# Altium schematic sheet Esquema_gen_ETRX.SchDoc
size 599 x 241 mm; SheetNumber: 1; SheetTotal: 5
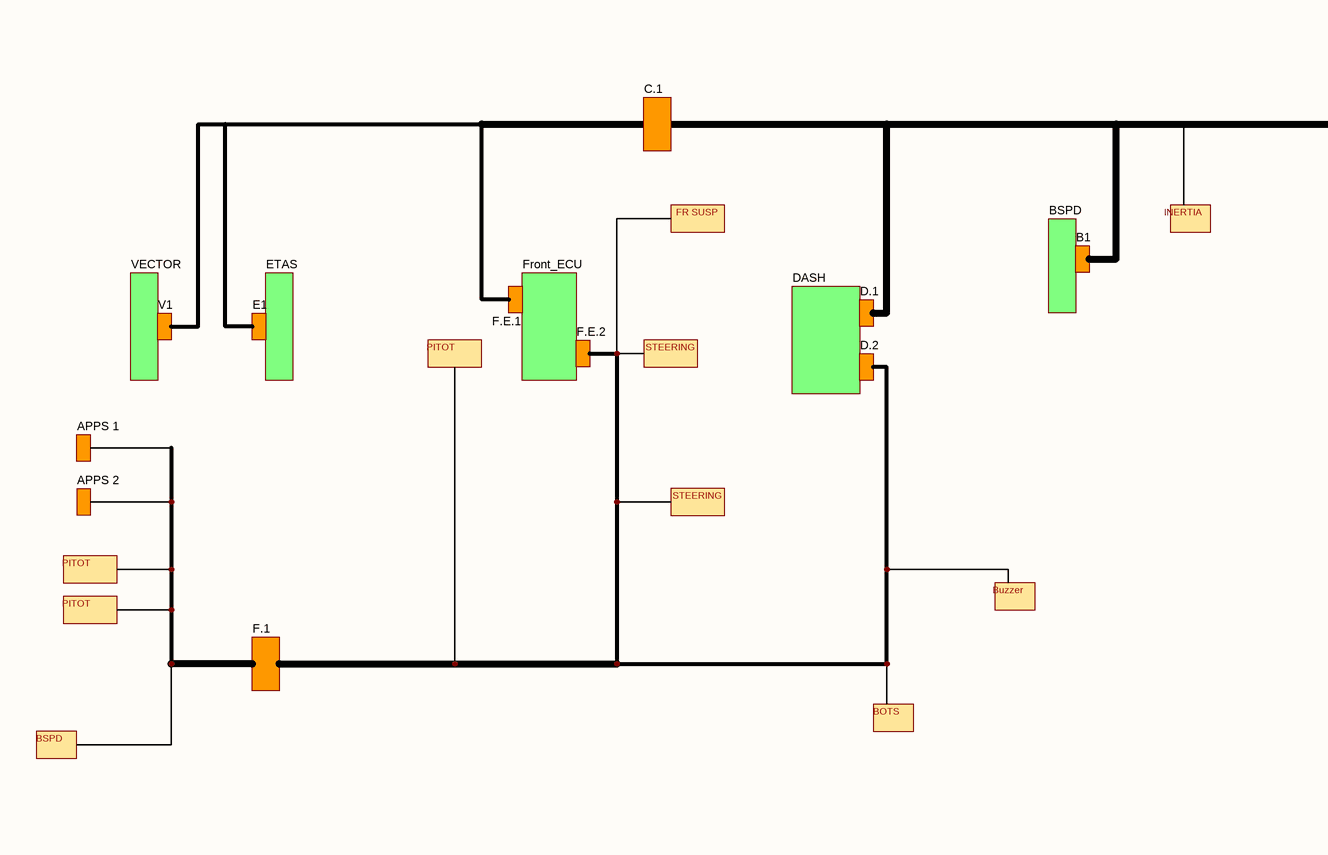
[diagram p0: Esquema_gen_ETRX.SchDoc, left]
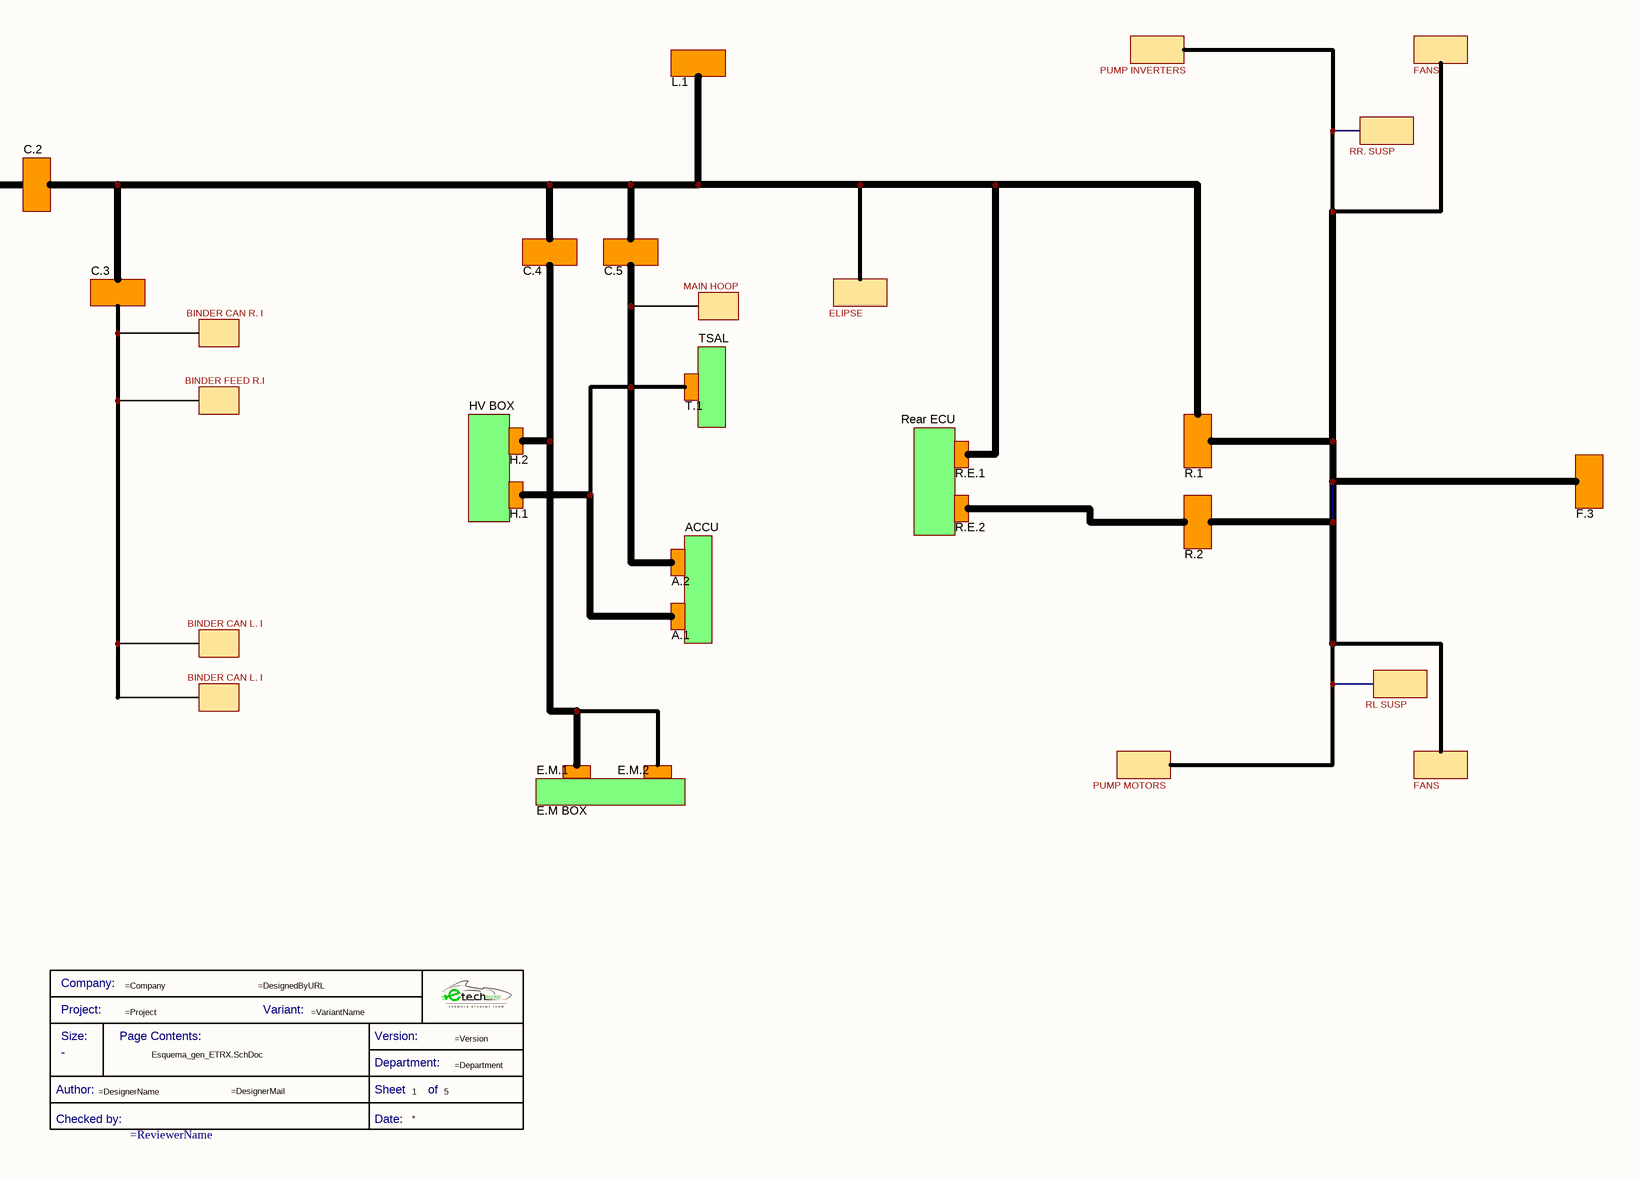
[diagram p1: Esquema_gen_ETRX.SchDoc, right]

## Parts
*  Title Block_template  (value not drawn)  (graphical)

## Sub-sheets
Designator = Rear ECU: no entries
Designator = HV BOX: no entries
Designator = DASH: no entries
Designator = E.M BOX: no entries
Designator = ACCU: no entries
Designator = ETAS: no entries
Designator = VECTOR: no entries
Designator = BSPD: no entries
Designator = TSAL: no entries
Designator = F.E.2: no entries
Designator = F.E.1: no entries
Designator = V1: no entries
Designator = E1: no entries
Designator = B1: no entries
Designator = D.1: no entries
Designator = D.2: no entries
Designator = APPS 1: no entries
Designator = APPS 2: no entries
Designator = C.1: no entries
Designator = F.1: no entries
Designator = C.2: no entries
Designator = C.3: no entries
Designator = C.4: no entries
Designator = C.5: no entries
Designator = H.2: no entries
Designator = H.1: no entries
Designator = A.2: no entries
Designator = A.1: no entries
Designator = T.1: no entries
Designator = E.M.1: no entries
Designator = E.M.2: no entries
Designator = L.1: no entries
Designator = R.E.1: no entries
Designator = R.E.2: no entries
Designator = R.1: no entries
Designator = R.2: no entries
Designator = F.3: no entries
Jose maricon = Front_ECU: no entries

## Notes on the sheet
- PUMP INVERTERS
- FANS
- RR. SUSP
- FR SUSP
- INERTIA
- BINDER CAN R. I
- MAIN HOOP
- ELIPSE
- BINDER FEED R.I
- PITOT
- STEERING
- Buzzer
- BINDER CAN L. I
- RL SUSP
- BOTS
- PUMP MOTORS
- BSPD
- (in symbol Title Block_template) Company:; Project:; Variant:; Size:; Page Contents:; Version:; Department:; Author:; Sheet; of; Checked by:; Date:

## Library data of the parts
* = Title Block_template: Standard Title Block; .Creator: GP; Category: Title Block; .PCBcheck: GP; .SCHcheck: GP; Checked by:: =ReviewerName; Size: -